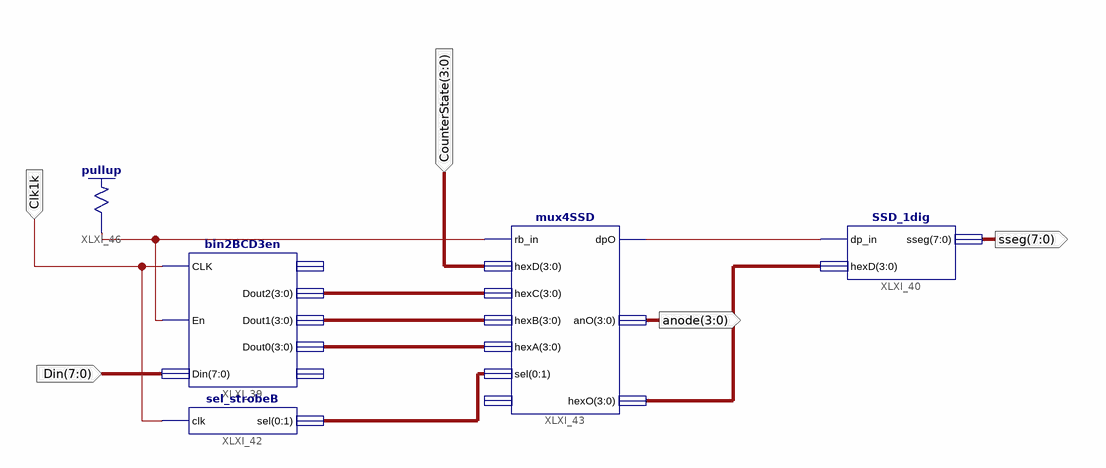
[diagram p0: schematic sheet 1]
// Xilinx ISE schematic HexSSEG.sch (spartan3e) as structural Verilog: 5 symbols, 5 ports
module HexSSEG (
  input  Clk1k,
  input  [7:0] Din,
  input  [3:0] CounterState,
  output [3:0] anode,
  output [7:0] sseg
);

  wire XLXN_6, XLXN_10;
  wire [1:0] XLXN_4;
  wire [3:0] XLXN_1, XLXN_2, XLXN_3, XLXN_5;

  bin2BCD3en XLXI_39 (
    .CLK(Clk1k), .En(XLXN_10), .Din(Din), .Dout2(XLXN_3), .Dout1(XLXN_2), .Dout0(XLXN_1));  // open: Dout3, RBout
  mux4SSD XLXI_43 (
    .rb_in(XLXN_10), .hexD(CounterState), .hexC(XLXN_3), .hexB(XLXN_2), .hexA(XLXN_1),
    .sel({XLXN_4[0], XLXN_4[1]}), .dpO(XLXN_6), .anO(anode), .hexO(XLXN_5));  // open: dp_in
  sel_strobeB XLXI_42 (.clk(Clk1k), .sel({XLXN_4[0], XLXN_4[1]}));
  SSD_1dig XLXI_40 (.dp_in(XLXN_6), .hexD(XLXN_5), .sseg(sseg));
  \pullup  XLXI_46 (.O(XLXN_10));
endmodule
